# EAGLE design virtual ground 4 (EAGLE 9.6.2)
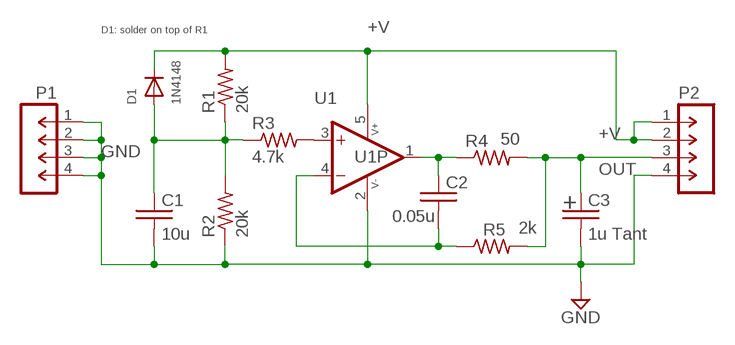
[diagram p0: schematic, sheet 1]

## Parts
C1  10u  C-USC0805  [C0805]
C2  0.05u  C-USC0805  [C0805]
C3  1u Tant  C-USC0805  [C0805]
D1  1N4148  DIODESOD-323F  [SOD-323F]
P1  M-1X04-SIP-100-40  [SIP-100-04-40]
P2  M-1X04-  [SIP-100-04-40_DON]
R1  20k  R-US_R0805  [R0805]
R2  20k  R-US_R0805  [R0805]
R3  4.7k  R-US_R0805  [R0805]
R4  50  R-US_R0805  [R0805]
R5  2k  R-US_R0805  [R0805]
U1  TLV9301IDBVR  OPA846DBV  [SOT23-5]

## Nets
+V [New Class]: D1.C P2.1 P2.2 R1.2 U1.5(P:V+)
GND: C1.2 C3.2 P1.1 P1.2 P1.3 P1.4 P2.4 R2.1 U1.2(P:V-)
N$1: R3.2 U1.3(A:+IN)
N$2: C2.2 R5.1 U1.4(A:-IN)
N$3: C1.1 D1.A R1.1 R2.2 R3.1
N$6 [New Class]: C2.1 R4.1 U1.1(A:OUT)
OUT [New Class]: C3.1 P2.3 R4.2 R5.2

## Notes on the sheet
- D1: solder on top of R1
- +

## Library data of the parts
C1-C3 = rcl:C-US: CAPACITOR, American symbol; SPICEPREFIX: C
D1 = adafruit:DIODE: Diode SMADIODE - SMA Surface Mount Package 20V 1A Schottky Diode Digikey: 641-1014-6-ND DO-1N4148 - Through Hole Small Current Diode SOD-123 20V 1 A (.5mV Vf) Schottky Diode - Digikey: MBRX120TPMSCT-ND SOD-323 10V 570mA (.38mV Vf, 3ns) Schottky Diode - Digikey: ZLLS410CT-ND SOD-523 30V 30mA Schottky Diode (RB751S-40TE61) - Digikey: RB751S-40TE61CT-ND SOT23-R/W - SOT23 Package (R = Solder Paste/Reflow Ovens, W = Hand-Soldering) BAT54Film 40V 300mA - Digikey: 497-7162-1-ND
P1 P2 = con-headers-jp:M-1X04-: MALE HEADER
R1-R5 = rcl:R-US_: RESISTOR, American symbol; SPICEPREFIX: R
U1 = op-amp:OPA846: OP-AMP Wideband, Low-Noise, Voltage-Feedback

## Net classes
1 New Class: width 0.254 mm

## Board
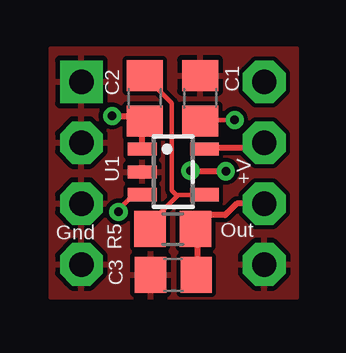
[diagram p1: board, top side]
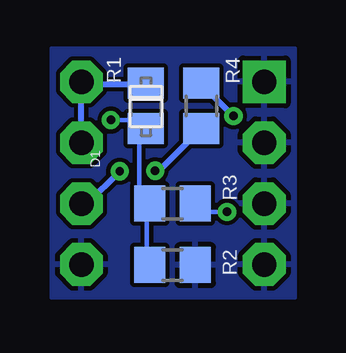
[diagram p2: board, bottom side, seen from below]

No outline drawn. Coordinates in mm, seen from the top.
Copper layers (1*16): Top 0.035mm / dielectric 1.5mm / Bottom 0.035mm
Design rules "default *": minimum track width 7mil, minimum drill 0.35mm, track to track 7mil, track to pad 7mil, pad to pad 7mil, via to via 7mil, smd to smd 7mil, copper to edge 0mil, drill to drill 7mil, minimum pad ring 10mil, minimum via ring 8mil, stop-mask expansion 4mil, vias tented up to drill 0mil, thermal gap 8mil

### Footprints (pad centres in the part's own frame; a part is rotated, then mirrored left to right if it is on the bottom)
C0805 = smd 1.3 x 1.5: 1 -0.95,0; 2 0.95,0
SOD-323F = smd 1 x 0.8: A -1,0; C 1,0
SIP-100-04-40 = drill 1.016 pad 1.778 square: 1 -3.81,0 | drill 1.016 pad 1.778 octagon: 2 -1.27,0; 3 1.27,0; 4 3.81,0
SIP-100-04-40_DON = drill 1.016 pad 1.778 octagon: 1 -3.81,0; 2 -1.27,0; 3 1.27,0; 4 3.81,0
R0805 = smd 1.3 x 1.5: 1 -0.95,0; 2 0.95,0
SOT23-5 = smd 0.55 x 1.2: 1 -0.95,-1.3; 2 0,-1.3; 3 0.95,-1.3; 4 0.95,1.3; 5 -0.95,1.3

### Placement (x,y rotation side)
C1  6.25,8.2 90 top
C2  3.94,8.2 90 top
C3  5.13,0.84 180 top
D1  6.22,7.86 90 bottom
P1  1.3,5.08 270 top
P2  8.92,5.08 270 top
R1  6.22,7.89 90 bottom
R2  5.12,1.24 180 bottom
R3  5.12,3.81 0 bottom
R4  3.91,7.89 270 bottom
R5  5.11,2.74 0 top
U1  5.13,5.13 270 top

### Tracks (layer width: path | path; a pad name or v marks a point on that pad's centre or on a via)
+V
  Top 0.254: 6.49,6.04 U1.5 6.58,6.13 8.71,6.13 8.89,6.31 P2.2
  Bottom 0.254: 6.22,8.89 D1.C R1.2 6.22,8.8 8.91,8.8 | P2.1 8.91,8.8 | P2.2 8.91,8.8
GND
  pour Bottom: 0,-0.13 0,10.29 10.16,10.29 10.16,-0.13
  pour Top: 0,-0.13 0,10.29 10.29,10.29 10.29,-0.13
N$1  (via drill 0.35)
  Top 0.178: v2.85,3.47 2.85,3.56 3.47,4.18 U1.3
  Bottom 0.178: v2.85,3.47 3.82,3.47 4.09,3.73 R3.2
N$2
  Top 0.178: 5.29,4.13 4.27,3.11 4.27,2.78 R5.1 | 5.29,4.13 5.33,4.18 6.4,4.18 U1.4 | 5.29,4.13 5.07,4.36 5.07,8 4,9.07 C2.2
N$3  (via drill 0.35)
  Top 0.178: 7.64,7.29 v7.68,7.3 7.62,7.3 6.35,7.3 C1.1
  Bottom 0.178: 6.19,3.81 6.19,1.27 R2.2 | 6.19,3.81 6.51,4.13 6.51,6.67 6.35,6.83 R1.1 | 7.64,7.29 v7.68,7.3 7.62,7.3 6.35,7.3 6.35,6.99 R1.1 | 6.19,3.81 R3.1 | R1.1 D1.A
N$6  (via drill 0.35)
  Top 0.254: U1.1 3.83,7.15 C2.1 3.72,7.47 v2.58,7.47
  Bottom 0.254: v2.58,7.47 3.91,8.8 R4.1
OUT  (via drill 0.35)
  Top 0.254: C3.1 6.13,0.89 6.13,2.65 R5.2 6.64,3.33 7.29,3.33 7.77,3.81 P2.3 | v7.32,5.16 5.87,5.16 v5.84,5.18
  Bottom 0.254: P2.3 8.66,3.81 v7.32,5.16 | v5.84,5.18 5.67,5.18 R4.2

### Text on the board
tNames: C2 | C1 | U1 | +V | Gnd | Out | C3
bNames: R4 | R1 | R3 | R2